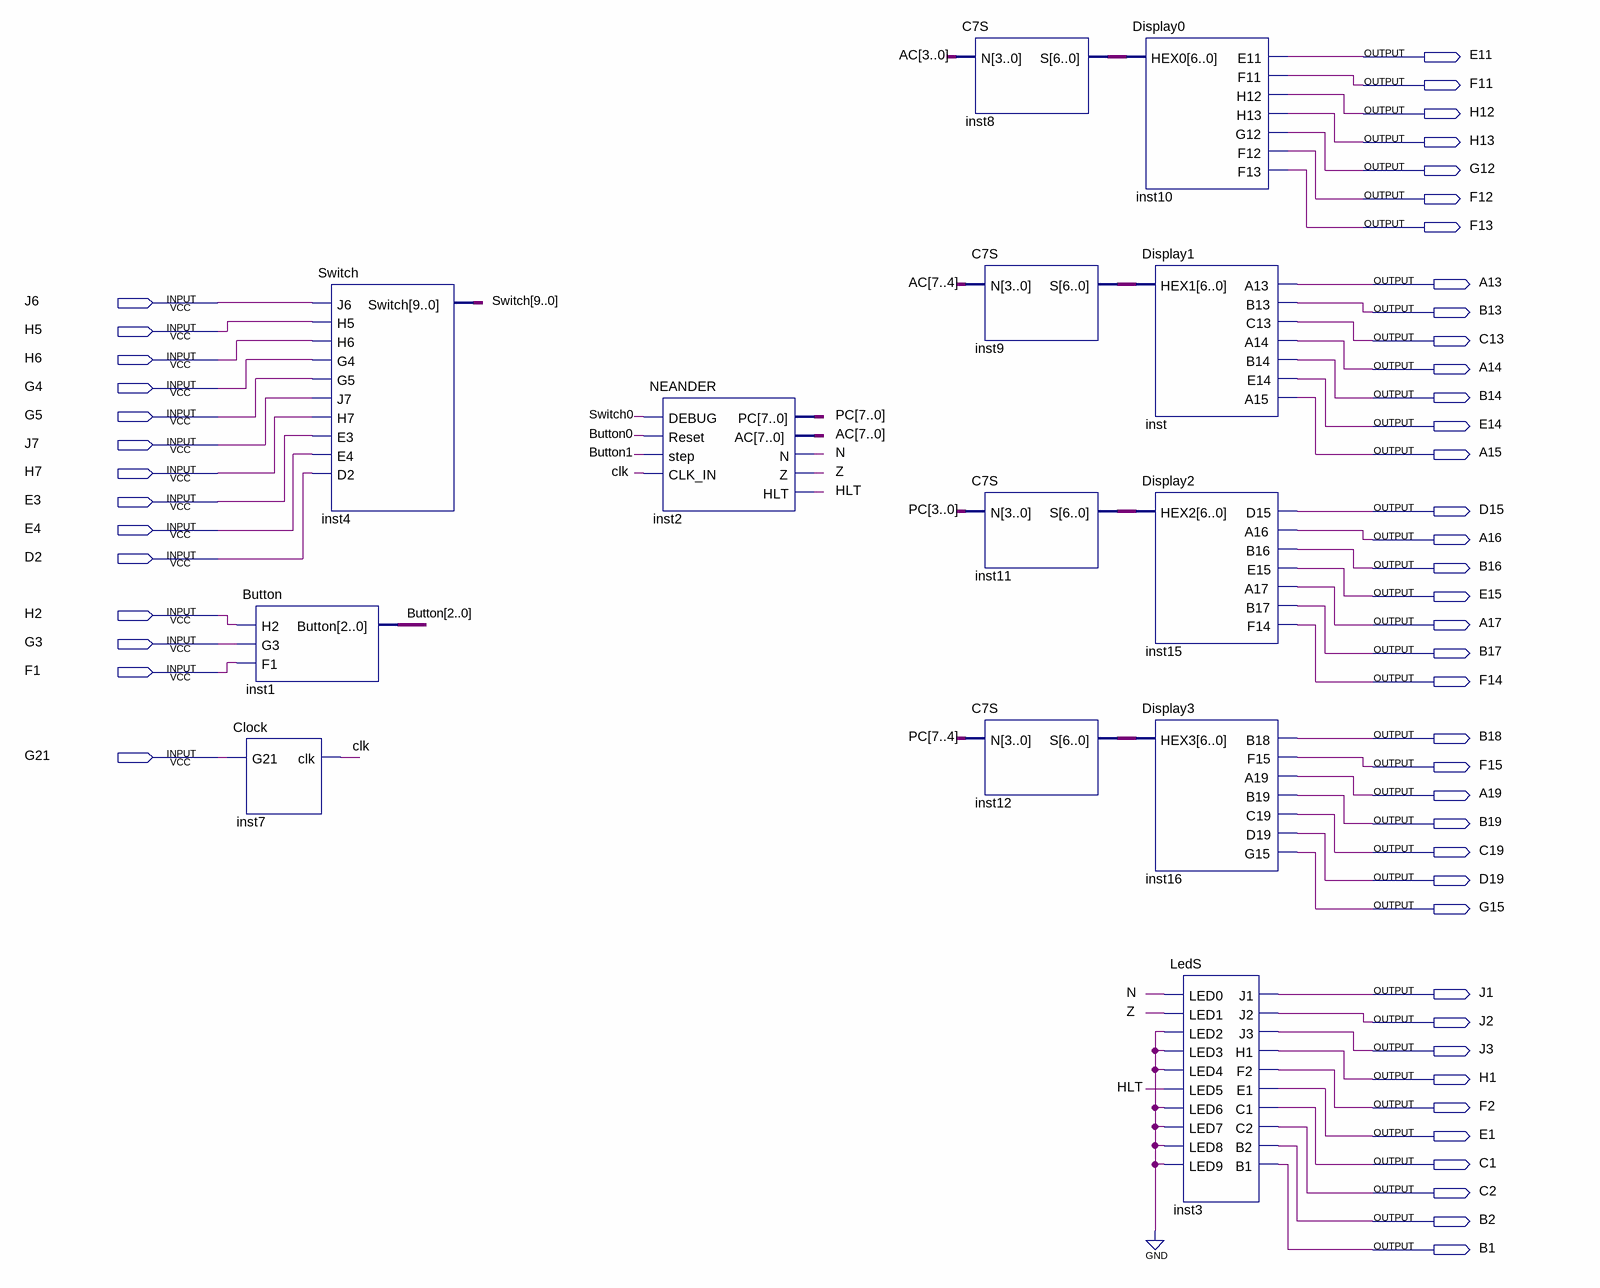
[diagram p0: schematic sheet]
// Quartus schematic UNITL.bdf as structural Verilog: 13 symbols, 52 pins
module UNITL (
  input  J6,
  input  H5,
  input  H6,
  input  G4,
  input  G5,
  input  J7,
  input  H7,
  input  E3,
  input  E4,
  input  D2,
  input  H2,
  input  G3,
  input  F1,
  input  G21,
  output E11,
  output F11,
  output H12,
  output H13,
  output G12,
  output F12,
  output F13,
  output A13,
  output B13,
  output C13,
  output A14,
  output B14,
  output E14,
  output A15,
  output D15,
  output A16,
  output B16,
  output E15,
  output A17,
  output B17,
  output F14,
  output B18,
  output F15,
  output A19,
  output B19,
  output C19,
  output D19,
  output G15,
  output J1,
  output J2,
  output J3,
  output H1,
  output F2,
  output E1,
  output C1,
  output C2,
  output B2,
  output B1
);

  wire clk, HLT, N, Z;
  wire [2:0] Button;
  wire [6:0] inst8_s, inst9_s, inst11_s, inst12_s;
  wire [7:0] AC, PC;
  wire [9:0] Switch;

  Button inst1 (.H2(H2), .G3(G3), .F1(F1), .Button(Button));
  Clock inst7 (.G21(G21), .clk(clk));
  Switch inst4 (
    .J6(J6), .H5(H5), .H6(H6), .G4(G4), .G5(G5), .J7(J7), .H7(H7), .E3(E3), .E4(E4), .D2(D2), .Switch(Switch));
  NEANDER inst2 (
    .DEBUG(Switch[0]), .Reset(Button[0]), .step(Button[1]), .CLK_IN(clk), .PC(PC), .AC(AC), .N(N), .Z(Z),
    .HLT(HLT));
  C7S inst8 (.N(AC[3:0]), .S(inst8_s));
  C7S inst9 (.N(AC[7:4]), .S(inst9_s));
  C7S inst11 (.N(PC[3:0]), .S(inst11_s));
  C7S inst12 (.N(PC[7:4]), .S(inst12_s));
  Display0 inst10 (.HEX0(inst8_s), .E11(E11), .F11(F11), .H12(H12), .H13(H13), .G12(G12), .F12(F12), .F13(F13));
  Display1 inst (.HEX1(inst9_s), .A13(A13), .B13(B13), .C13(C13), .A14(A14), .B14(B14), .E14(E14), .A15(A15));
  Display2 inst15 (.HEX2(inst11_s), .D15(D15), .A16(A16), .B16(B16), .E15(E15), .A17(A17), .B17(B17), .F14(F14));
  Display3 inst16 (.HEX3(inst12_s), .B18(B18), .F15(F15), .A19(A19), .B19(B19), .C19(C19), .D19(D19), .G15(G15));
  LedS inst3 (
    .LED0(N), .LED1(Z), .LED2(1'b0), .LED3(1'b0), .LED4(1'b0), .LED5(HLT), .LED6(1'b0), .LED7(1'b0),
    .LED8(1'b0), .LED9(1'b0), .J1(J1), .J2(J2), .J3(J3), .H1(H1), .F2(F2), .E1(E1), .C1(C1), .C2(C2),
    .B2(B2), .B1(B1));
endmodule
